# EAGLE design sd_shield_v_1-0-0-0a (EAGLE 6.4)
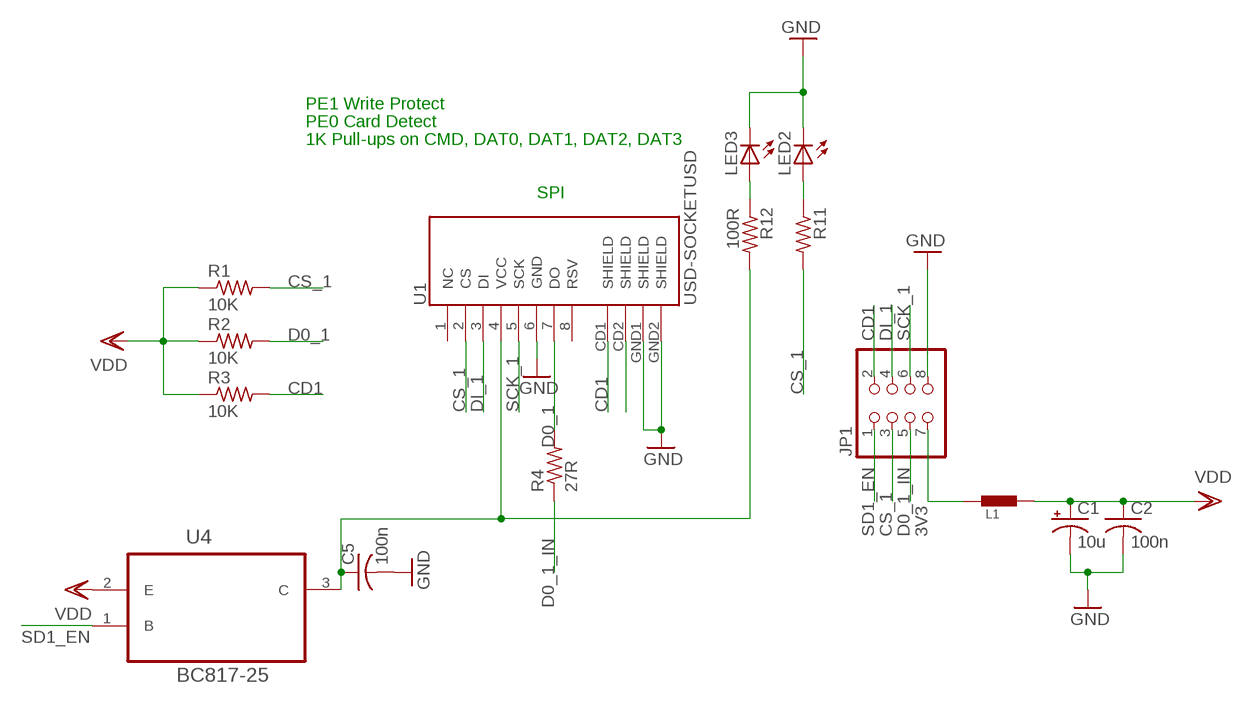
[diagram p0: schematic, sheet 1]

## Parts
C1  10u  CPOL-USB/3528-21W  [B/3528-21W]
C2  100n  C-USC0603  [C0603]
C5  100n  C-USC0603  [C0603]
JP1  PINHD-2X4  [2X04]
L1  FERRITE  [0805]
LED2  LEDCHIP-LED0603  [CHIP-LED0603]
LED3  LEDCHIP-LED0603  [CHIP-LED0603]
R1  10K  R-US_R0603  [R0603]
R2  10K  R-US_R0603  [R0603]
R3  10K  R-US_R0603  [R0603]
R4  27R  R-US_R0603  [R0603]
R11  R-US_R0603  [R0603]
R12  100R  R-US_R0603  [R0603]
U1  USD-SOCKETUSD  [USD-SOCKET-PP]
U4  BC817-25  [SOT95P240X97-3N]

## Nets
3V3: JP1.7 L1.1
CD1: JP1.2 R3.2 U1.CD1(SHIELD)
CS_1: JP1.3 R1.2 R11.2 U1.2(CS)
D0_1: R2.2 R4.2 U1.7(DO)
D0_1_IN: JP1.5 R4.1
DI_1: JP1.4 U1.3(DI)
GND: C1.- C2.2 C5.2 JP1.8 LED2.C LED3.C U1.6(GND) U1.GND1(SHIELD) U1.GND2(SHIELD)
N$2: LED2.A R11.1
N$3: LED3.A R12.1
N$4: C5.1 R12.2 U1.4(VCC) U4.3(C)
N$10: U1.CD2(SHIELD)
SCK_1: JP1.6 U1.5(SCK)
SD1_EN: JP1.1 U4.1(B)
VDD: C1.+ C2.1 L1.2 R1.1 R2.1 R3.1 U4.2(E)
Unconnected: U1.1(NC) U1.8(RSV)

## Notes on the sheet
- PE1 Write Protect
- PE0 Card Detect
- 1K Pull-ups on CMD, DAT0, DAT1, DAT2, DAT3
- SPI

## Library data of the parts
C1 = rcl:CPOL-US: POLARIZED CAPACITOR, American symbol
C2 C5 = rcl:C-US: CAPACITOR, American symbol
JP1 = pinhead:PINHD-2X4: PIN HEADER
L1 = AWJLEagleLib:FERRITE: Ferrite bead
LED2 LED3 = adafruit:LED: LED OSRAM: - CHIPLED LG R971, LG N971, LY N971, LG Q971, LY Q971, LO R971, LY R971 LH N974, LH R974 LS Q976, LO Q976, LY Q976 LO Q996 - Hyper CHIPLED LW Q18S LB Q993, LB Q99A, LB R99A - SideLED LS A670, LO A670, LY A670, LG A670, LP A670 LB A673, LV A673, LT A673, LW A673 LH A674 LY A675 LS A676, LA A676, LO A676, LY A676, LW A676 LS A679, LY A679, LG A679 - Hyper Micro SIDELED® LS Y876, LA Y876, LO Y876, LY Y876 LT Y87S - SmartLED LW L88C, LW L88S LB L89C, LB L89S, LG L890 LS L89K, LO L89K, LY L89K LS L896, LA L896, LO L896, LY L896 - TOPLED LS T670, LO T670, LY T670, LG T670, LP T670 LSG T670, LSP T670, LSY T670, LOP T670, LYG T670 LG T671, LOG T671, LSG T671 LB T673, LV T673, LT T673, LW T673 LH T674 LS T676, LA T676, LO T676, LY T676, LB T676, LH T676, LSB T676, LW T676 LB T67C, LV T67C, LT T67C, LS T67K, LO T67K, LY T67K, LW E67C LS E67B, LA E67B, LO E67B, LY E67B, LB E67C, LV E67C, LT E67C LW T67C LS T679, LY T679, LG T679 LS T770, LO T770, LY T770, LG T770, LP T770 LB T773, LV T773, LT T773, LW T773 LH T774 LS E675, LA E675, LY E675, LS T675 LS T776, LA T776, LO T776, LY T776, LB T776 LHGB T686 LT T68C, LB T68C - Hyper Mini TOPLED® LB M676 - Mini TOPLED Santana® LG M470 LS M47K, LO M47K, LY M47K Source: http://www.osram.convergy.de/
R1-R4 R11 R12 = rcl:R-US_: RESISTOR, American symbol
U1 = SparkFun-Connectors:USD-SOCKET: microSD Socket Push-push type uSD socket. Schematic element and footprint production proven. Spark Fun Electronics SKU : PRT-00127. tDoc lines correctly indicate media card edge positions when inserting (unlocked, locked, depressed).
U4 = Fairchild_By_element14_Batch_1:BC817-25: NPN Epitaxial Silicon Transistor; MPN: BC817-25; OC_FARNELL: 1228216; OC_NEWARK: -; PACKAGE: SOT-3; SUPPLIER: Fairchild

## Board
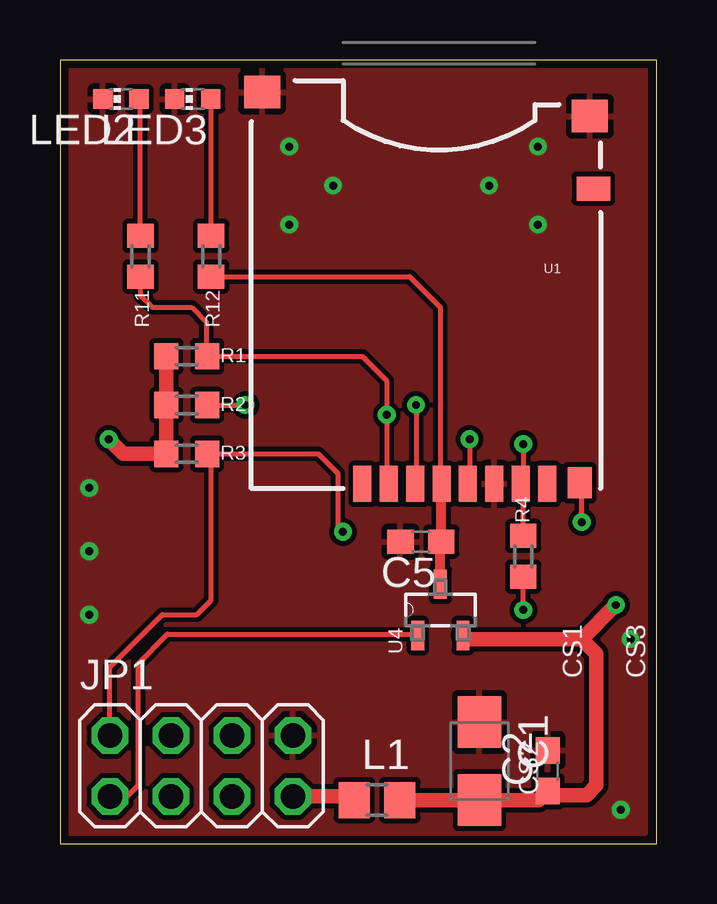
[diagram p1: board, top side]
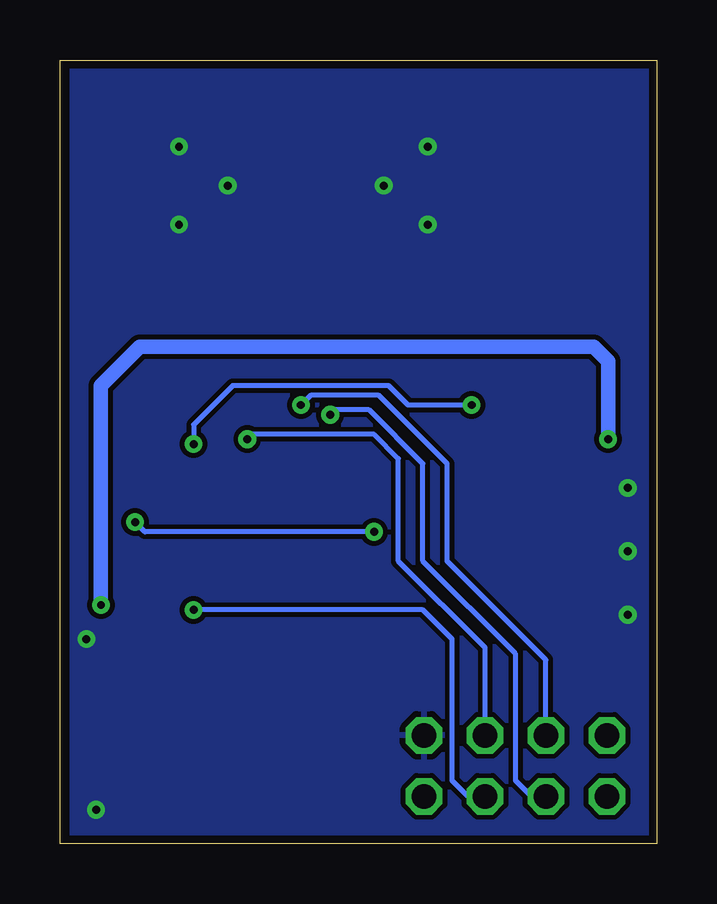
[diagram p2: board, bottom side, seen from below]

Size 24.87 x 32.66 mm. Coordinates in mm from the lower left corner, seen from the top.
Outline: 0,0 24.87,0 24.87,32.66 0,32.66 0,0
Copper layers (1*16): Top 0.035mm / dielectric 1.5mm / Bottom 0.035mm
Design rules "default *": minimum track width 10mil, minimum drill 24mil, track to track 8mil, track to pad 8mil, pad to pad 8mil, via to via 8mil, smd to smd 8mil, copper to edge 13mil, drill to drill 8mil, minimum pad ring 10mil, minimum via ring 8mil, stop-mask expansion 4mil, vias tented up to drill 0mil, thermal gap 10mil

### Footprints (pad centres in the part's own frame; a part is rotated, then mirrored left to right if it is on the bottom)
B/3528-21W = smd 2.15 x 1.8: + 1.625,0; - -1.625,0
C0603 = smd 1.1 x 1: 1 -0.85,0; 2 0.85,0
2X04 = drill 1.016 octagon: 1 -3.81,-1.27; 2 -3.81,1.27; 3 -1.27,-1.27; 4 -1.27,1.27; 5 1.27,-1.27; 6 1.27,1.27; 7 3.81,-1.27; 8 3.81,1.27
0805 = smd 1.3 x 1.5: 1 -0.95,0; 2 0.95,0
CHIP-LED0603 = smd 0.8 x 0.8: A 0,-0.75; C 0,0.75
R0603 = smd 1 x 1.1: 1 -0.85,0; 2 0.85,0
USD-SOCKET-PP = smd 0.75 x 1.5: 1 3.2,16.8; 2 2.1,16.8; 3 1,16.8; 4 -0.1,16.8; 5 -1.2,16.8; 6 -2.3,16.8; 7 -3.4,16.8; 8 -4.5,16.8 | smd 1 x 1.3: CD1 -5.85,16.75 | smd 1.4 x 1: CD2 -6.425,4.5 | smd 1.5 x 1.35: GND1 -6.275,1.475; GND2 7.375,0.475
SOT95P240X97-3N = smd 1.219 x 0.533: 1 -1.067,0.94; 2 -1.067,-0.94; 3 1.067,0

### Placement (x,y rotation side)
C1  17.48,3.45 270 top
C2  20.32,3.05 90 top
C5  15.04,12.6 180 top
JP1  5.89,3.25 0 top
L1  13.21,1.83 0 top
LED2  2.54,31.04 90 top
LED3  5.54,31.04 90 top
R1  5.28,20.32 0 top
R2  5.28,18.29 0 top
R3  5.28,16.26 0 top
R4  19.3,11.99 90 top
R11  3.35,24.49 270 top
R12  6.3,24.49 270 top
U1  15.8,31.8 180 top
U4  15.85,9.75 90 top

### Tracks (layer width: path | path; a pad name or v marks a point on that pad's centre or on a via)
3V3
  Top 0.61: JP1.7 12.11,1.98 L1.1
CD1  (via drill 0.33)
  Top 0.203: v11.79,13 11.58,13.21 11.58,15.44 10.77,16.26 R3.2 6.3,16.09 6.3,10.16 5.69,9.55 4.27,9.55 2.08,7.37 JP1.2 | v21.74,13.41 21.74,14.96 U1.CD1
  Bottom 0.203: v11.79,13 21.34,13 v21.74,13.41
CS_1  (via drill 0.33)
  Top 0.203: U1.2 13.61,15.09 v13.61,17.88 13.61,19.3 12.6,20.32 R1.2 6.1,20.36 6.1,21.74 5.49,22.35 3.86,22.35 3.35,22.86 R11.2
  Bottom 0.203: JP1.3 5.23,1.98 5.89,2.64 5.89,7.92 9.75,11.79 9.75,15.85 11.99,18.08 13.41,18.08 v13.61,17.88
D0_1  (via drill 0.33)
  Top 0.203: R4.2 19.3,14.9 U1.7 19.3,15.11 v19.3,16.66 | R2.2 v7.72,18.29
  Bottom 0.203: v7.72,18.29 10.36,18.29 11.18,19.1 17.68,19.1 19.3,17.48 v19.3,16.66
D0_1_IN  (via drill 0.33)
  Top 0.203: v19.3,9.75 R4.1
  Bottom 0.203: JP1.5 7.87,1.98 8.53,2.64 8.53,8.53 9.75,9.75 v19.3,9.75
DI_1  (via drill 0.33)
  Top 0.203: v14.83,18.29 14.83,15.04 U1.3
  Bottom 0.203: JP1.4 4.62,7.67 8.74,11.79 8.74,15.85 11.58,18.69 14.43,18.69 v14.83,18.29
GND  (via drill 0.33)
  other vias: 23.77,8.53 23.37,1.42 1.22,14.83 1.22,12.19 1.22,9.55 9.55,29.06 9.55,25.81 11.38,27.43 19.91,29.06 19.91,25.81 17.88,27.43
  pour Bottom: 0.41,32.31 24.38,32.31 24.38,0.41 0.41,0.41
  pour Top: 0.41,32.31 24.38,32.31 24.38,0.41 0.41,0.41
N$2
  Top 0.203: R11.1 3.35,30.98 LED2.A
N$3
  Top 0.203: R12.1 LED3.A
N$4
  Top 0.203: R12.2 14.57,23.64 15.85,22.35 15.85,15.05 U1.4
  Top 0.406: U4.3 15.85,12.56 C5.1 15.89,14.99 U1.4
SCK_1  (via drill 0.33)
  Top 0.203: v17.07,16.87 17.07,15.07 U1.5
  Bottom 0.203: JP1.6 7.16,8.18 10.77,11.79 10.77,16.05 11.79,17.07 16.87,17.07 v17.07,16.87
SD1_EN
  Top 0.203: JP1.1 2.79,1.98 3.25,2.44 3.25,7.52 4.47,8.74 14.86,8.74 U4.1
VDD  (via drill 0.33)
  Top 0.406: 20.49,2.03 C2.1
  Top 0.61: L1.2 17.27,1.83 17.68,1.42 17.68,1.63 C1.+ 19.95,1.83 C2.1 | 20.49,2.03 21.95,2.03 22.35,2.44 22.35,7.92 21.74,8.53 | 21.74,8.53 16.94,8.53 U4.2 | R1.1 R2.1 R3.1 2.64,16.26 v2.03,16.87 | v23.16,9.96 21.74,8.53
  Bottom 0.61: v2.03,16.87 2.03,20.12 2.64,20.73 21.54,20.73 23.16,19.1 v23.16,9.96

### Text on the board
tPlace: CS1 | CS3 | CS2
tDocu: SD Card with SPI Connection